# EAGLE design relayBoard (EAGLE 9.2.2)
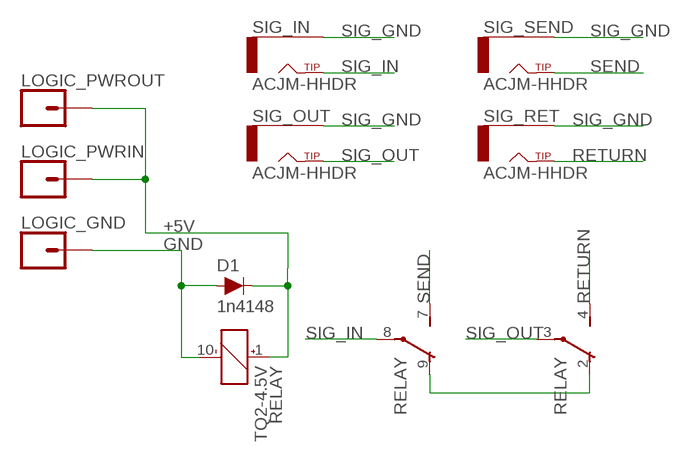
[diagram p0: schematic, sheet 1]

## Parts
D1  1n4148  DIODE-1N4148  [DIODE-1N4148]
LOGIC_GND  CONN_01  [1X01]
LOGIC_PWRIN  CONN_01  [1X01]
LOGIC_PWROUT  CONN_01  [1X01]
RELAY  TQ2-4.5V  [TQ2]
SIG_IN  ACJM-HHDR  [ACJM-HHDR]
SIG_OUT  ACJM-HHDR  [ACJM-HHDR]
SIG_RET  ACJM-HHDR  [ACJM-HHDR]
SIG_SEND  ACJM-HHDR  [ACJM-HHDR]

## Nets
+5V: D1.C LOGIC_PWRIN.1 LOGIC_PWROUT.1 RELAY.1(_:+)
GND: D1.A LOGIC_GND.1 RELAY.10(_:-)
N$24: RELAY.2(1:O) RELAY.9(2:O)
RETURN: RELAY.4(1:S) SIG_RET.TIP_1(TIP) SIG_RET.TIP_2(TIP)
SEND: RELAY.7(2:S) SIG_SEND.TIP_1(TIP) SIG_SEND.TIP_2(TIP)
SIG_GND: SIG_IN.SLEEVE_1(SLEEVE) SIG_IN.SLEEVE_2(SLEEVE) SIG_OUT.SLEEVE_1(SLEEVE) SIG_OUT.SLEEVE_2(SLEEVE) SIG_RET.SLEEVE_1(SLEEVE) SIG_RET.SLEEVE_2(SLEEVE) SIG_SEND.SLEEVE_1(SLEEVE) SIG_SEND.SLEEVE_2(SLEEVE)
SIG_IN: RELAY.8(2:P) SIG_IN.TIP_1(TIP) SIG_IN.TIP_2(TIP)
SIG_OUT: RELAY.3(1:P) SIG_OUT.TIP_1(TIP) SIG_OUT.TIP_2(TIP)

## Library data of the parts
D1 = SparkFun-DiscreteSemi:DIODE: Diode These are standard reverse protection diodes and small signal diodes. SparkFun Products: SparkFun SparkPunk Sound Kit <https://www.sparkfun.com/products/11177> SparkFun ESP8266 Thing <https://www.sparkfun.com/products/13231>; PROD_ID: DIO-08378; VALUE: 200mA/100V/1V
LOGIC_GND LOGIC_PWRIN LOGIC_PWROUT = SparkFun-Connectors:CONN_01: Single connection point. Often used as Generic Header-pin footprint for 0.1 inch spaced/style header connections On any of the 0.1 inch spaced packages, you can populate with these: Break Away Headers - Straight <https://www.sparkfun.com/products/116> (PRT-00116) Break Away Male Headers - Right Angle <https://www.sparkfun.com/products/553> (PRT-00553) Female Headers <https://www.sparkfun.com/products/115> (PRT-00115) Break Away Headers - Machine Pin <https://www.sparkfun.com/products/117> (PRT-00117) Break Away Female Headers - Swiss Machine Pin <https://www.sparkfun.com/products/743> (PRT-00743) This device is also useful as a general connection point to wire up your design to another part of your project. Our various solder wires solder well into these plated through hole pads. Hook-Up Wire - Assortment (Stranded, 22 AWG) <https://www.sparkfun.com/products/11375> (PRT-11375) Hook-Up Wire - Assortment (Solid Core, 22 AWG) <https://www.sparkfun.com/products/11367> (PRT-11367) View the entire wire category on our website here <https://www.sparkfun.com/categories/141> Special notes: SMTSO-256-ET is a "flush mount" nut for a 4-40 screw. We mostly use this on specialty testbeds; it is a nice way to connect hardware to your PCB at an adjustable hieght. Also note, the SNAP packages are for using a snappable style connector. We sell a baggie of snaps and they are also used on two LilyPad designs: Snap Assortment - 30 pack (male and female) <https://www.sparkfun.com/products/11347> (DEV-11347) LilyPad Arduino SimpleSnap <https://www.sparkfun.com/products/10941> (DEV-10941) LilyPad SimpleSnap Protoboard <https://www.sparkfun.com/products/10940> (DEV-10940)
RELAY = relay:TQ2?*: LOW PROFILE 2 FORM C RELAY NAiS Source: http://www.mew-europe.com/.. en_ds_61020_0001.pdf Source: http://www.mew-europe.com/.. en_ds_61020_0004.pdf; MF: AROMAT/ MATSUSHITA; MPN: TQ2-4.5V; OC_FARNELL: 1163566; OC_NEWARK: 64K3199
SIG_IN SIG_OUT SIG_RET SIG_SEND = My-SMD-Library:ACJM-HHDR

## Board
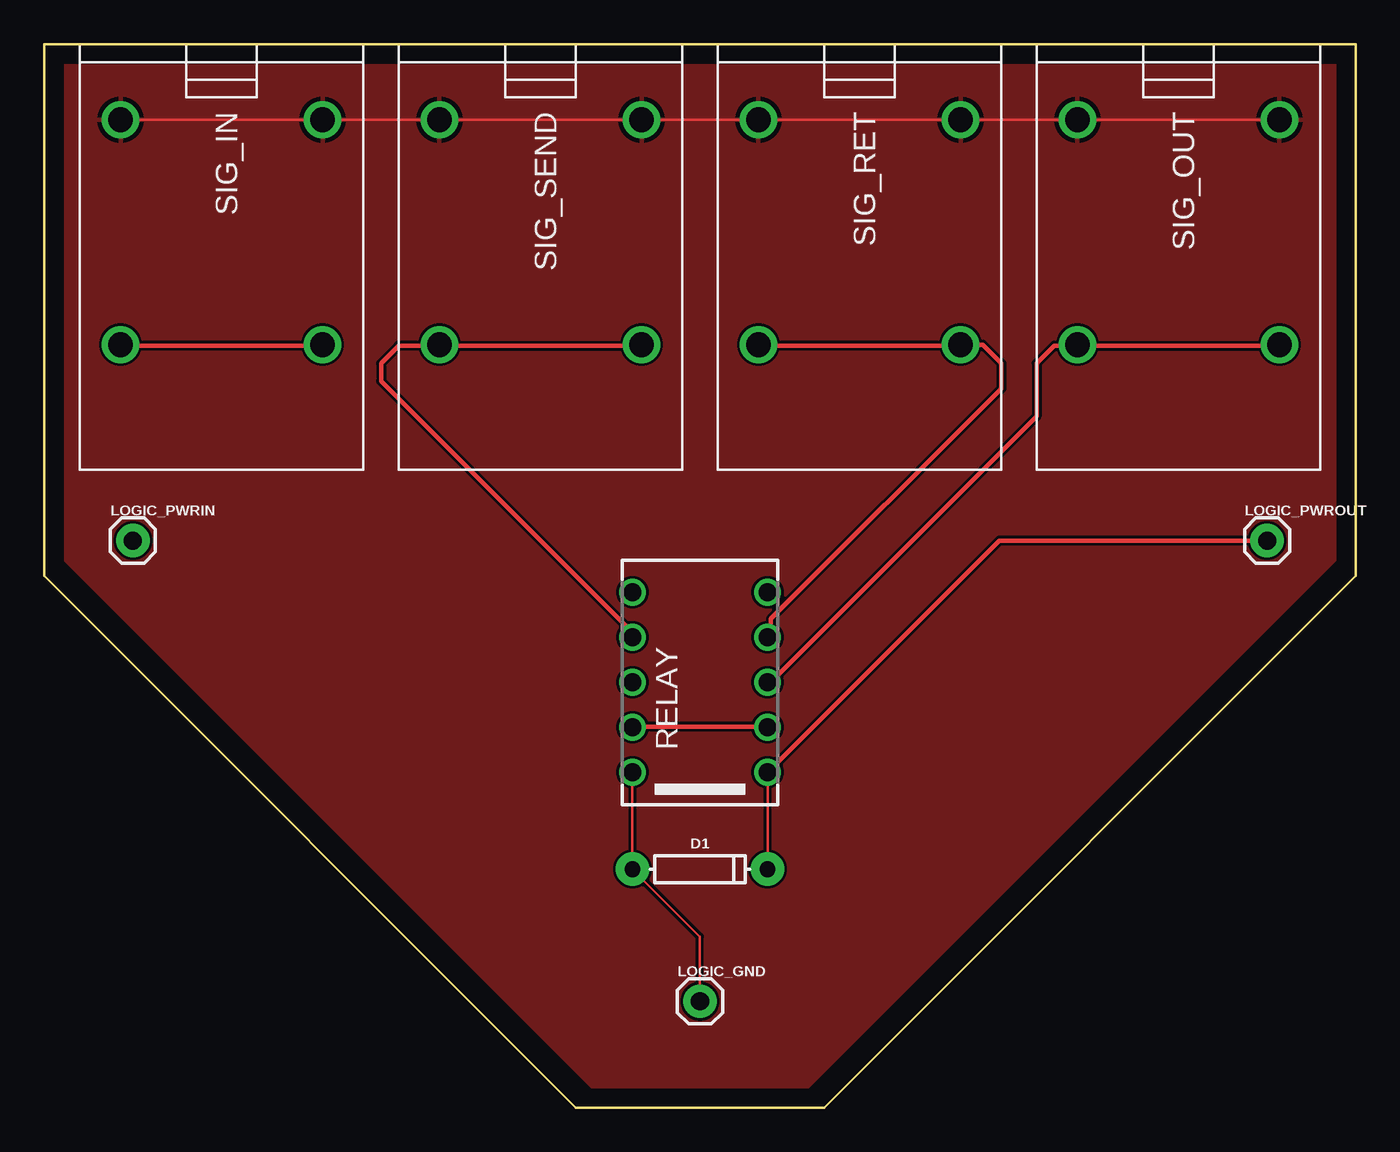
[diagram p1: board, top side]
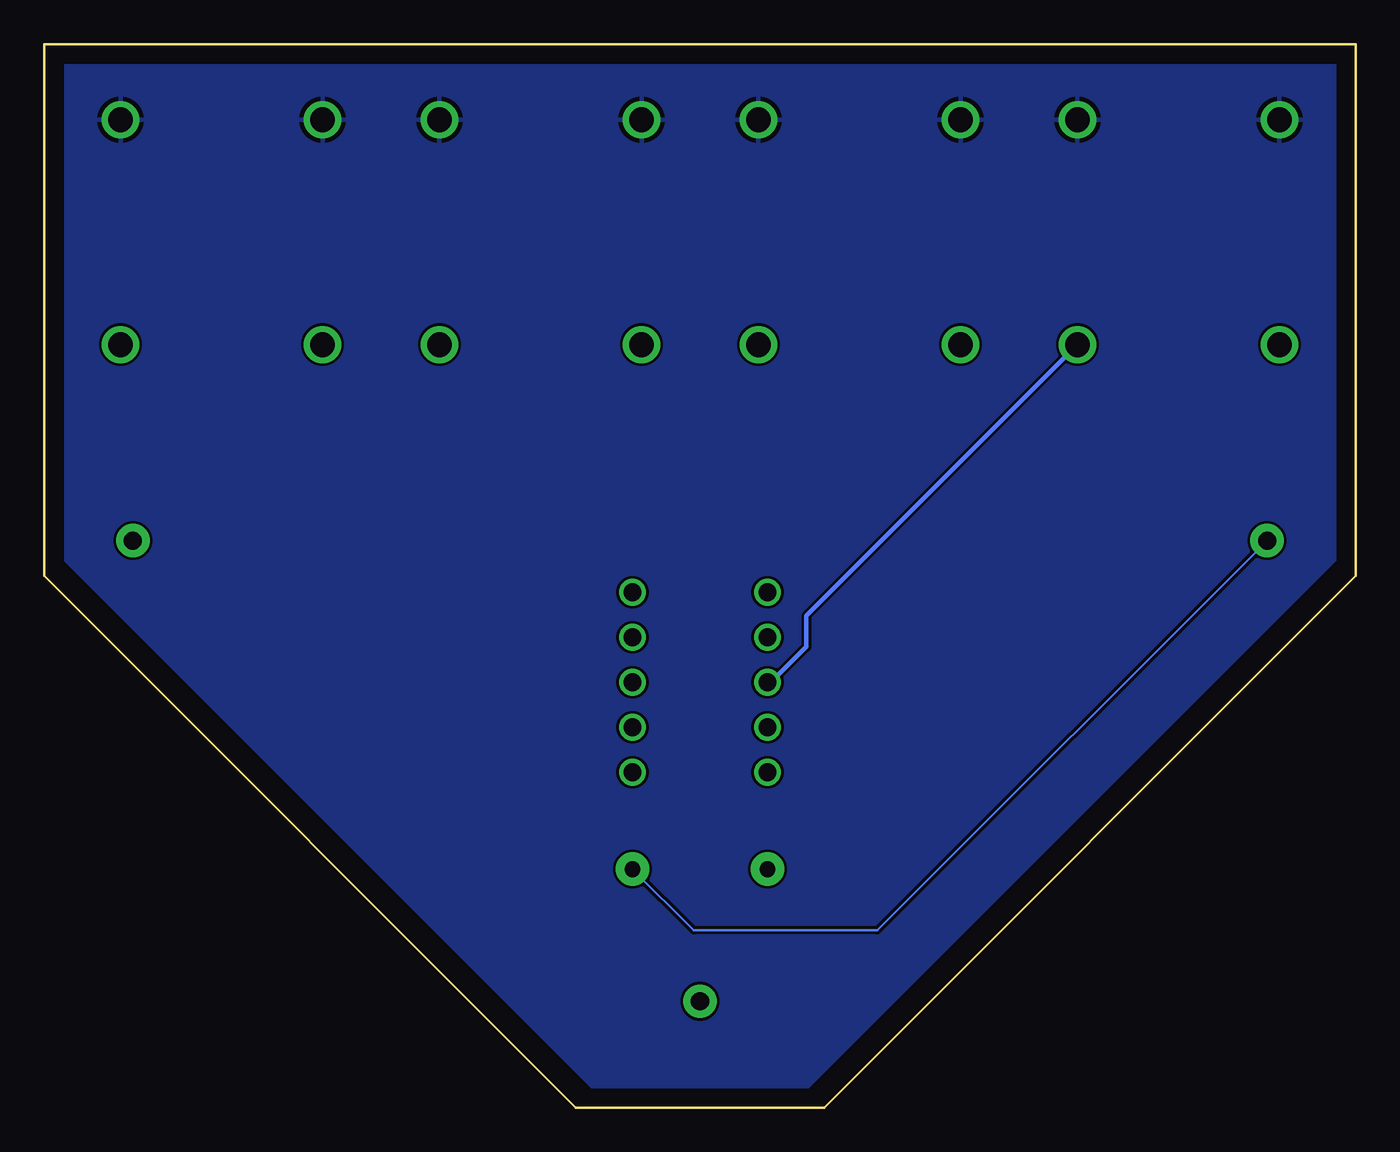
[diagram p2: board, bottom side, seen from below]

Size 74 x 60 mm. Coordinates in mm from the lower left corner, seen from the top.
Outline: 0,60 74,60 74,30 44,0 30,0 0,30 0,60
Copper layers (1*16): Top 0.035mm / dielectric 1.5mm / Bottom 0.035mm
Design rules "default": minimum track width 6mil, minimum drill 0.35mm, track to track 6mil, track to pad 6mil, pad to pad 6mil, via to via 6mil, smd to smd 6mil, copper to edge 40mil, drill to drill 6mil, minimum pad ring 10mil, minimum via ring 8mil, stop-mask expansion 4mil, vias tented up to drill 0mil, thermal gap 10mil

### Footprints (pad centres in the part's own frame; a part is rotated, then mirrored left to right if it is on the bottom)
DIODE-1N4148 = drill 0.9 pad 1.88: A -3.81,0; C 3.81,0
1X01 = drill 1.016 pad 1.88: 1 0,0
TQ2 = drill 1: 1 -5.08,-3.81; 2 -2.54,-3.81; 3 0,-3.81; 4 2.54,-3.81; 5 5.08,-3.81; 6 5.08,3.81; 7 2.54,3.81; 8 0,3.81; 9 -2.54,3.81; 10 -5.08,3.81
ACJM-HHDR = drill 1.4: SLEEVE_1 4.25,2.3; SLEEVE_2 4.25,13.7; TIP_1 16.95,2.3; TIP_2 16.95,13.7

### Placement (x,y rotation side)
D1  37,13.46 0 top
LOGIC_GND  37,6 0 top
LOGIC_PWRIN  5,32 0 top
LOGIC_PWROUT  69,32 0 top
RELAY  37,24 90 top
SIG_IN  2,60 270 top
SIG_OUT  56,60 270 top
SIG_RET  38,60 270 top
SIG_SEND  20,60 270 top

### Tracks (layer width: path | path; a pad name or v marks a point on that pad's centre or on a via)
+5V
  Top 0.152: D1.C RELAY.1
  Top 0.254: LOGIC_PWROUT.1 53.89,32 RELAY.1
  Bottom 0.152: LOGIC_PWRIN.1 27,10 37.35,10 D1.C
GND
  Top 0.152: RELAY.10 D1.A 37,9.65 LOGIC_GND.1
N$24
  Top 0.152: 33.5,21.5 RELAY.9 | 40.5,21.5 RELAY.2
  Top 0.254: 40.5,21.5 33.5,21.5
RETURN
  Top 0.152: 41,27 RELAY.4 | 40.5,43 SIG_RET.TIP_1 | 51.5,43 SIG_RET.TIP_2 51.5,43
  Top 0.254: 51.5,43 40.5,43 | SIG_RET.TIP_2 52.95,43.05 54,42 54,40.58 41,27.57 41,27
SEND
  Top 0.152: 33,27 RELAY.7 | 33.5,43 SIG_SEND.TIP_2 | 22.5,43 SIG_SEND.TIP_1 22.5,43
  Top 0.254: 22.5,43 33.5,43 | SIG_SEND.TIP_1 22.25,43 20,43 19,42 19,41 33,27
SIG_GND
  Top 0.152: SIG_IN.SLEEVE_1 SIG_IN.SLEEVE_2 SIG_SEND.SLEEVE_1 SIG_SEND.SLEEVE_2 SIG_RET.SLEEVE_1 SIG_RET.SLEEVE_2 SIG_OUT.SLEEVE_1 SIG_OUT.SLEEVE_2
  pour Top: 1,59 1,31 31,1 36,1 43,1 73,31 73,59
  pour Bottom: 1,59 1,31 31,1 43,1 73,31 73,59
SIG_IN
  Top 0.152: 33,24 RELAY.8 | 16,43 SIG_IN.TIP_2 15.5,43 | 4.5,43 SIG_IN.TIP_1
  Top 0.254: 15.5,43 4.5,43
  Bottom 0.254: SIG_IN.TIP_2 31,27.75 31,26 33,24 RELAY.8
SIG_OUT
  Top 0.152: 41,24 RELAY.3 | 58,43 SIG_OUT.TIP_1 58.5,43 | 69.5,43 SIG_OUT.TIP_2
  Top 0.254: 58.5,43 69.5,43 | SIG_OUT.TIP_1 58.25,43 | SIG_OUT.TIP_1 58.25,43 | SIG_OUT.TIP_1 58.25,43 | 58.25,43 57,43 56,42 56,39 41,24